# Altium schematic sheet CTL_RELAY_SHEET2_CCU_HAS.SchDoc: CCU - Damper Relays
size B; DrawnBy: M. Seago; Organization: Gravitas; Address1: Sponsored By:; Address2: Alan Morgan; Address3: Technical Advisor:; Address4: Dr. Joseph Morgan; Revision: 1A; SheetNumber: 8; SheetTotal: 9
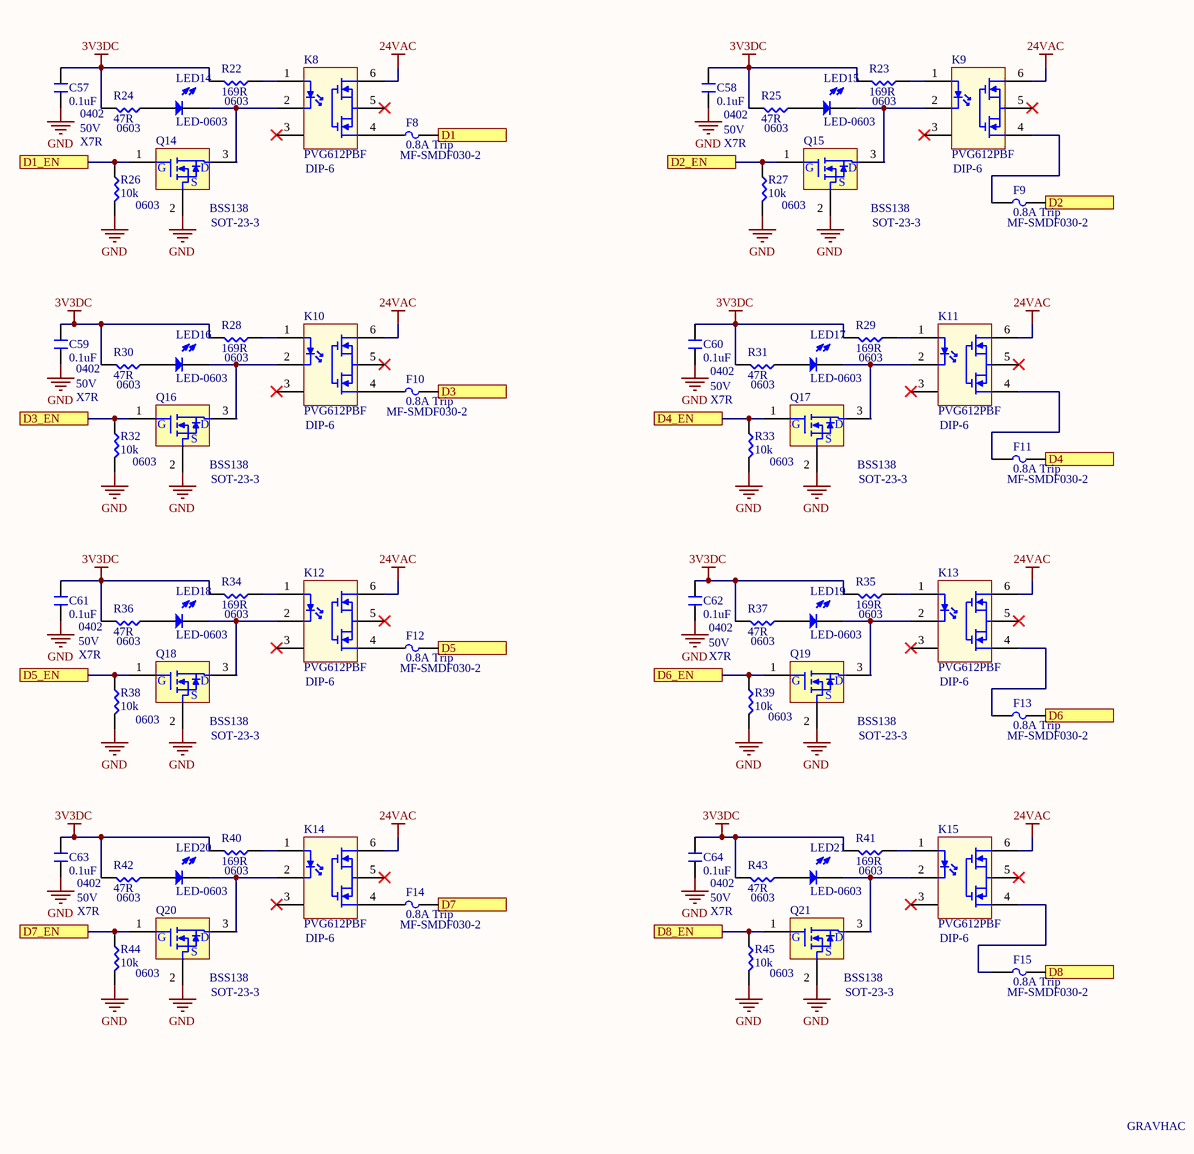
[diagram p0: CTL_RELAY_SHEET2_CCU_HAS.SchDoc]

## Parts
C57  0.1uF  [NonPolar-0402]
C58  0.1uF  [NonPolar-0402]
C59  0.1uF  [NonPolar-0402]
C60  0.1uF  [NonPolar-0402]
C61  0.1uF  [NonPolar-0402]
C62  0.1uF  [NonPolar-0402]
C63  0.1uF  [NonPolar-0402]
C64  0.1uF  [NonPolar-0402]
F8  0.8A Trip  [Fuse-MF-SMDF030-2]
F9  0.8A Trip  [Fuse-MF-SMDF030-2]
F10  0.8A Trip  [Fuse-MF-SMDF030-2]
F11  0.8A Trip  [Fuse-MF-SMDF030-2]
F12  0.8A Trip  [Fuse-MF-SMDF030-2]
F13  0.8A Trip  [Fuse-MF-SMDF030-2]
F14  0.8A Trip  [Fuse-MF-SMDF030-2]
F15  0.8A Trip  [Fuse-MF-SMDF030-2]
K8  PVG612PBF  [PVG612PBF]
K9  PVG612PBF  [PVG612PBF]
K10  PVG612PBF  [PVG612PBF]
K11  PVG612PBF  [PVG612PBF]
K12  PVG612PBF  [PVG612PBF]
K13  PVG612PBF  [PVG612PBF]
K14  PVG612PBF  [PVG612PBF]
K15  PVG612PBF  [PVG612PBF]
LED14  LED-0603  [LED-0603]
LED15  LED-0603  [LED-0603]
LED16  LED-0603  [LED-0603]
LED17  LED-0603  [LED-0603]
LED18  LED-0603  [LED-0603]
LED19  LED-0603  [LED-0603]
LED20  LED-0603  [LED-0603]
LED21  LED-0603  [LED-0603]
Q14  BSS138  [BSS138-SOT23]
Q15  BSS138  [BSS138-SOT23]
Q16  BSS138  [BSS138-SOT23]
Q17  BSS138  [BSS138-SOT23]
Q18  BSS138  [BSS138-SOT23]
Q19  BSS138  [BSS138-SOT23]
Q20  BSS138  [BSS138-SOT23]
Q21  BSS138  [BSS138-SOT23]
R22  169R  [NonPolar-0603]
R23  169R  [NonPolar-0603]
R24  47R  [NonPolar-0603]
R25  47R  [NonPolar-0603]
R26  10k  [NonPolar-0603]
R27  10k  [NonPolar-0603]
R28  169R  [NonPolar-0603]
R29  169R  [NonPolar-0603]
R30  47R  [NonPolar-0603]
R31  47R  [NonPolar-0603]
R32  10k  [NonPolar-0603]
R33  10k  [NonPolar-0603]
R34  169R  [NonPolar-0603]
R35  169R  [NonPolar-0603]
R36  47R  [NonPolar-0603]
R37  47R  [NonPolar-0603]
R38  10k  [NonPolar-0603]
R39  10k  [NonPolar-0603]
R40  169R  [NonPolar-0603]
R41  169R  [NonPolar-0603]
R42  47R  [NonPolar-0603]
R43  47R  [NonPolar-0603]
R44  10k  [NonPolar-0603]
R45  10k  [NonPolar-0603]

## Ports
D1, D1_EN, D2, D2_EN, D3, D3_EN, D4, D4_EN, D5, D5_EN, D6, D6_EN, D7, D7_EN, D8, D8_EN

## Nets
3V3DC: C57.2 C58.2 C59.2 C60.2 C61.2 C62.2 C63.2 C64.2 R22.1 R23.1 R24.1 R25.1 R28.1 R29.1 R30.1 R31.1 R34.1 R35.1 R36.1 R37.1 R40.1 R41.1 R42.1 R43.1
24VAC: K8.6 K9.6 K10.6 K11.6 K12.6 K13.6 K14.6 K15.6
GND: C57.1 C58.1 C59.1 C60.1 C61.1 C62.1 C63.1 C64.1 Q14.2(S) Q15.2(S) Q16.2(S) Q17.2(S) Q18.2(S) Q19.2(S) Q20.2(S) Q21.2(S) R26.1 R27.1 R32.1 R33.1 R38.1 R39.1 R44.1 R45.1
D1: F8.2 ; port D1
D1_EN: Q14.1(G) R26.2 ; port D1_EN
D2: F9.2 ; port D2
D2_EN: Q15.1(G) R27.2 ; port D2_EN
D3: F10.2 ; port D3
D3_EN: Q16.1(G) R32.2 ; port D3_EN
D4: F11.2 ; port D4
D4_EN: Q17.1(G) R33.2 ; port D4_EN
D5: F12.2 ; port D5
D5_EN: Q18.1(G) R38.2 ; port D5_EN
D6: F13.2 ; port D6
D6_EN: Q19.1(G) R39.2 ; port D6_EN
D7: F14.2 ; port D7
D7_EN: Q20.1(G) R44.2 ; port D7_EN
D8: F15.2 ; port D8
D8_EN: Q21.1(G) R45.2 ; port D8_EN
NetF8_1: F8.1 K8.4
NetF9_1: F9.1 K9.4
NetF10_1: F10.1 K10.4
NetF11_1: F11.1 K11.4
NetF12_1: F12.1 K12.4
NetF13_1: F13.1 K13.4
NetF14_1: F14.1 K14.4
NetF15_1: F15.1 K15.4
NetK8_1: K8.1 R22.2
NetK8_2: K8.2 LED14.2 Q14.3(D)
NetK9_1: K9.1 R23.2
NetK9_2: K9.2 LED15.2 Q15.3(D)
NetK10_1: K10.1 R28.2
NetK10_2: K10.2 LED16.2 Q16.3(D)
NetK11_1: K11.1 R29.2
NetK11_2: K11.2 LED17.2 Q17.3(D)
NetK12_1: K12.1 R34.2
NetK12_2: K12.2 LED18.2 Q18.3(D)
NetK13_1: K13.1 R35.2
NetK13_2: K13.2 LED19.2 Q19.3(D)
NetK14_1: K14.1 R40.2
NetK14_2: K14.2 LED20.2 Q20.3(D)
NetK15_1: K15.1 R41.2
NetK15_2: K15.2 LED21.2 Q21.3(D)
NetLED14_1: LED14.1 R24.2
NetLED15_1: LED15.1 R25.2
NetLED16_1: LED16.1 R30.2
NetLED17_1: LED17.1 R31.2
NetLED18_1: LED18.1 R36.2
NetLED19_1: LED19.1 R37.2
NetLED20_1: LED20.1 R42.2
NetLED21_1: LED21.1 R43.2

Not connected (* = marked no-connect by the designer): K8 3(18)* 5(14)*; K9 3(18)* 5(14)*; K10 3(18)* 5(14)*; K11 3(18)* 5(14)*; K12 3(18)* 5(14)*; K13 3(18)* 5(14)*; K14 3(18)* 5(14)*; K15 3(18)* 5(14)*

## Notes on the sheet
- (near R24) 0402
- 50V
- (near R24) 0603
- (near R22) 0603
- 0402
- (near R25) 0603
- (near R23) 0603
- X7R
- (near K8) DIP-6
- (near F8) MF-SMDF030-2
- DIP-6
- 0603
- (near Q14) SOT-23-3
- (near Q15) SOT-23-3
- (near F9) MF-SMDF030-2
- (near R30) 0603
- (near R28) 0603
- (near R31) 0603
- (near R29) 0603
- (near K10) DIP-6
- (near F10) MF-SMDF030-2
- (near K11) DIP-6
- (near Q16) SOT-23-3
- (near Q17) SOT-23-3
- (near F11) MF-SMDF030-2
- (near R36) 0402
- (near R36) 0603
- (near R34) 0603
- (near F12) MF-SMDF030-2
- (near R37) 0603
- (near R35) 0603
- (near Q18) SOT-23-3
- (near K12) DIP-6
- (near Q19) 0603
- (near Q19) SOT-23-3
- (near K13) DIP-6
- (near F13) MF-SMDF030-2
- (near R40) 0603
- (near R41) 0603
- (near R42) 0603
- (near K14) DIP-6
- (near F14) MF-SMDF030-2
- (near R43) 0603
- (near K15) DIP-6
- (near Q20) 0603
- (near Q20) SOT-23-3
- (near Q21) 0603
- (near Q21) SOT-23-3
- (near F15) MF-SMDF030-2
- GRAVHAC
- Title
- Size:
- Date:
- B
- Drawn By:
- Revision:
- Sheet
- of
- File:

## Library data of the parts
C57-C64 = Cap - 0402
F8-F15 = Fuse-MF-SMDF030-2
K8-K15 = PVG612PBF: PhotoVoltaic Relay
R22-R45 = Res - 0603